# Altium schematic sheet Arduino Connector.SchDoc: Arduino Connector
size A4; CompanyName: STMicroelectronics; Organization: Microcontrollers Division; DocumentNumber: 10; SheetNumber: 16; SheetTotal: 19
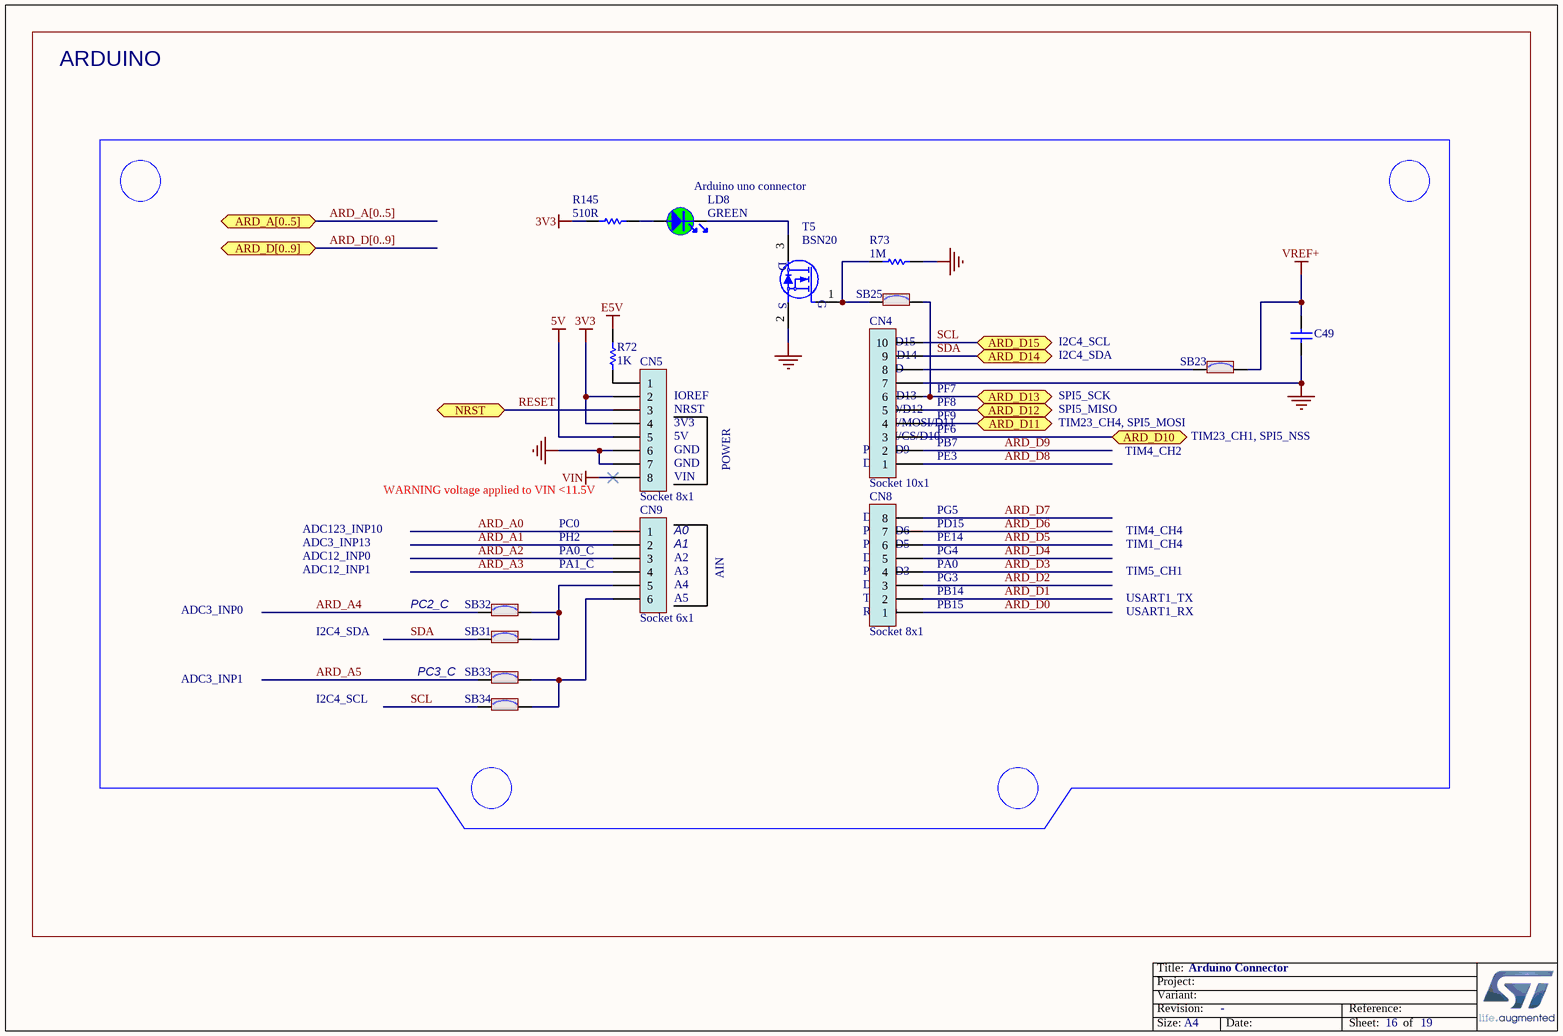
[diagram p0: Arduino Connector.SchDoc]

## Parts
C49  Capacitor  [C0603]  (value not drawn)
CN4  Socket 10x1  [CON_SAMTEC_SSW-110-22-X-S-VS]
CN5  Socket 8x1  [CON_SAMTEC_SSW-108-22-X-S-VS]
CN8  Socket 8x1  [CON_SAMTEC_SSW-108-22-X-S-VS]
CN9  Socket 6x1  [CON_SAMTEC_SSW-106-22-X-S-VS]
LD8  value GREEN  [LED_0603_GREEN]  (hidden comment: LED_green)
R72  value 1K  [R0603]  (hidden comment: Resistor)
R73  value 1M  [R0603]  (hidden comment: Resistor)
R145  value 510R  [R0603]  (hidden comment: Resistor)
SB23  SB_ON  [SOLDER-BRIDGE_R0603-0R]  (value not drawn)
SB25  SB_ON  [SOLDER-BRIDGE_R0603-0R]  (value not drawn)
SB31  SB_ON  [SOLDER-BRIDGE_R0603-0R]  (value not drawn)
SB32  SB_ON  [SOLDER-BRIDGE_R0603-0R]  (value not drawn)
SB33  SB_ON  [SOLDER-BRIDGE_R0603-0R]  (value not drawn)
SB34  SB_ON  [SOLDER-BRIDGE_R0603-0R]  (value not drawn)
T5  BSN20  [MOS_SOT23]

## Ports
ARD_A[0..5], ARD_D10, ARD_D11, ARD_D12, ARD_D13, ARD_D14, ARD_D15, ARD_D[0..9], NRST

## Nets
3V3: CN5.2 CN5.4 R145.2
5V: CN5.5
E5V: R72.1
GND: C49.1 CN4.7 CN5.6 CN5.7 R73.2 T5.2(S)
VIN: CN5.8
VREF+: C49.2 SB23.2
ARD_A0: CN9.1
ARD_A1: CN9.2
ARD_A2: CN9.3
ARD_A3: CN9.4
ARD_A4: SB32.1
ARD_A5: SB33.1
ARD_D0: CN8.1
ARD_D1: CN8.2
ARD_D2: CN8.3
ARD_D3: CN8.4
ARD_D4: CN8.5
ARD_D5: CN8.6
ARD_D6: CN8.7
ARD_D7: CN8.8
ARD_D8: CN4.1
ARD_D9: CN4.2
ARD_D10: CN4.3 ; port ARD_D10
ARD_D11: CN4.4 ; port ARD_D11
ARD_D12: CN4.5 ; port ARD_D12
ARD_D13: CN4.6 SB25.2 ; port ARD_D13
RESET: CN5.3 ; port NRST
SCL: CN4.10 SB34.1 ; port ARD_D15
SDA: CN4.9 SB31.1 ; port ARD_D14
NetCN4_8: CN4.8 SB23.1
NetCN5_1: CN5.1 R72.2
NetCN9_5: CN9.5 SB31.2 SB32.2
NetCN9_6: CN9.6 SB33.2 SB34.2
NetLD8_1: LD8.1 R145.1
NetLD8_2: LD8.2 T5.3(D)
NetR73_1: R73.1 SB25.1 T5.1(G)

## Buses and harness runs
bus ARD_A[0..5] = port ARD_A[0..5]
bus ARD_D[0..9] = port ARD_D[0..9]

## Notes on the sheet
- ARDUINO
- (near LD8) Arduino uno connector
- (near CN4) SDA/D14
- SCL/D15
- (near CN4) AVDD
- (near CN4) GND
- I2C4_SCL
- I2C4_SDA
- (near CN5) IOREF
- (near CN5) NRST
- (near CN5) 3V3
- (near CN5) 5V
- (near CN4) PWM/CS/D10
- (near CN4) SCK/D13
- (near CN4) MISO/D12
- (near CN4) PWM/MOSI/D11
- (near CN4) PF6
- (near CN4) PB7
- (near CN4) PF9
- (near CN4) PF8
- (near CN4) PF7
- TIM23_CH4, SPI5_MOSI
- SPI5_MISO
- SPI5_SCK
- TIM23_CH1, SPI5_NSS
- WARNING voltage applied to VIN <11.5V
- (near CN5) GND
- (near CN5) VIN
- POWER
- (near CN8) D7
- (near CN4) D8
- (near CN4) PWM/D9
- PG5
- (near CN4) PE3
- TIM4_CH2
- ADC12_INP1
- ADC12_INP0
- ADC3_INP13
- ADC123_INP10
- PC0
- PH2
- PA0_C
- PA1_C
- (near CN9) A0
- (near CN9) A1
- (near CN9) A2
- (near CN9) A3
- AIN
- (near CN8) D4
- (near CN8) PWM/D3
- (near CN8) PWM/D5
- (near CN8) PWM/D6
- (near CN8) PG3
- (near CN8) PG4
- (near CN8) PE14
- (near CN8) PD15
- (near CN8) PA0
- TIM1_CH4
- TIM5_CH1
- TIM4_CH4
- ADC3_INP0
- PC2_C
- (near CN9) A4
- (near CN9) A5
- (near CN8) RX/D0
- (near CN8) TX/D1
- (near CN8) D2
- (near CN8) PB14
- (near CN8) PB15
- USART1_RX
- USART1_TX
- ADC3_INP1
- PC3_C
- Title:
- Project:
- Size:
- Revision:
- Variant:
- -
- Date:
- Reference:
- Sheet:
- of

## Library data of the parts
C49 = MCD-00211: Capacitor, MLCC, 100nF, 16V, X7R, 10%, 0603, T=0,8mm; Manufacturer_Part_Number: CC0603KRX7R7BB104; Manufacturer: YAGEO; Provided_By: SUBCO; Internal_Part_Number: MCD-00211; Value: 100nF; Status: Released; Part_Type: Capacitor; Package: C0603; ComponentLink1Description: Datasheet; ComponentLink1URL: http://tunmcdsvn.tun.st.com/Component_Datasheet_Library/Trunk/Capacitors/Yageo_Multilayer_Capacitor_X7R_series_100pF_to_22uF
CN4 = MCD-00301: Socket, 10x1, 2.54mm, VR, SMT, Height 9.78mm; Manufacturer_Part_Number: SSW-110-22-L-S-VS; Manufacturer: SAMTEC; Part_Type: Connector; Provided_By: SUBCO; Internal_Part_Number: MCD-00301; Value: Socket 10x1; ComponentLink1Description: Datasheet; Status: Checked; ComponentLink1URL: http://tunmcdsvn.tun.st.com/Component_Datasheet_Library/Trunk/Connectors/Samtec_SSW_smt_series
CN5 = MCD-00300: Socket, 8x1, 2.54mm, VR, SMT, Height 9.78mm; Manufacturer_Part_Number: SSW-108-22-L-S-VS; Manufacturer: SAMTEC; Part_Type: Connector; Provided_By: SUBCO; Internal_Part_Number: MCD-00300; Value: Socket 8x1; ComponentLink1Description: Datasheet; Status: Checked; ComponentLink1URL: http://tunmcdsvn.tun.st.com/Component_Datasheet_Library/Trunk/Connectors/Samtec_SSW_smt_series
CN8 = MCD-00300: Socket, 8x1, 2.54mm, VR, SMT, Height 9.78mm; Part_Type: Connector; Manufacturer_Part_Number: SSW-108-22-L-S-VS; Manufacturer: SAMTEC; Provided_By: SUBCO; Internal_Part_Number: MCD-00300; Value: Socket 8x1; Status: Checked; ComponentLink1Description: Datasheet; ComponentLink1URL: http://tunmcdsvn.tun.st.com/Component_Datasheet_Library/Trunk/Connectors/Samtec_SSW_smt_series
CN9 = MCD-00299: Socket, 6x1, 2.54mm, VR, SMT, Height 9.78mm; Part_Type: Connector; Manufacturer_Part_Number: SSW-106-22-L-S-VS; Manufacturer: SAMTEC; Provided_By: SUBCO; Internal_Part_Number: MCD-00299; Value: Socket 6x1; Status: Checked; ComponentLink1Description: Datasheet; ComponentLink1URL: http://tunmcdsvn.tun.st.com/Component_Datasheet_Library/Trunk/Connectors/Samtec_SSW_smt_series
LD8 = MCD-00050: LED, Green, 0603; Part_Type: Display; Manufacturer_Part_Number: 19-213SYGC/S530-E2/TR8; Manufacturer: EVERLIGHT; Provided_By: SUBCO; Internal_Part_Number: MCD-00050; Status: Released; ComponentLink1Description: Datasheet; ComponentLink1URL: http://tunmcdsvn.tun.st.com/Component_Datasheet_Library/Trunk/Display/Everlight_SMD-LED-GREEN_19-213SYGC-S530-XX-TR8-v3.doc; Package: LED 0603
R72 = MCD-00070: Resistor,1K,0603,1%,1/10W; Manufacturer_Part_Number: RC0603FR-071KL; Manufacturer: YAGEO; Provided_By: SUBCO; Internal_Part_Number: MCD-00070; Status: Released; Part_Type: Resistor; Package: R0603; ComponentLink1Description: Datasheet; ComponentLink1URL: http://tunmcdsvn.tun.st.com/Component_Datasheet_Library/Trunk/Resistors/Yageo_Resistor_RC0603-series
R73 = MCD-00257: Resistor,1M,0603,1%,1/10W; Manufacturer_Part_Number: RC0603FR-071ML; Manufacturer: YAGEO; Provided_By: SUBCO; Internal_Part_Number: MCD-00257; Status: Released; Part_Type: Resistor; Package: R0603; ComponentLink1Description: Datasheet; ComponentLink1URL: http://tunmcdsvn.tun.st.com/Component_Datasheet_Library/Trunk/Resistors/Yageo_Resistor_RC0603-series
R145 = MCD-00225: Resistor,510R,0603,1%,1/10W; Manufacturer_Part_Number: RC0603FR-07510RL; Manufacturer: YAGEO; Provided_By: SUBCO; Internal_Part_Number: MCD-00225; ComponentLink1Description: Datasheet; Status: Released; Part_Type: Resistor; Package: R0603; ComponentLink1URL: http://tunmcdsvn.tun.st.com/Component_Datasheet_Library/Trunk/Resistors/Yageo_Resistor_RC0603-series
SB23 SB25 SB31-SB34 = MCD-00071: Solder Bridge ON; Part_Type: Mechanical; Manufacturer_Part_Number: RC0603JR-070RL; Manufacturer: YAGEO; Provided_By: SUBCO; Internal_Part_Number: MCD-00071; Status: Released; Package: SB0603; ComponentLink1Description: Datasheet; ComponentLink1URL: http://tunmcdsvn.tun.st.com/Component_Datasheet_Library/Trunk/Resistors/Yageo_Resistor_RC0603-series
T5 = MCD-00151: N-channel enhancement mode field-effect transistor; Part_Type: IC; Manufacturer: NXP; Provided_By: SUBCO; Internal_Part_Number: MCD-00151; Value: BSN20; Status: Released; Manufacturer_Part_Number: BSN20; ComponentLink1Description: Datasheet; ComponentLink1URL: http://tunmcdsvn.tun.st.com/Component_Datasheet_Library/Trunk/IC/NXP_Transistor_BSN20BK_SOT23